# EAGLE design pcb (EAGLE 9.6.2)
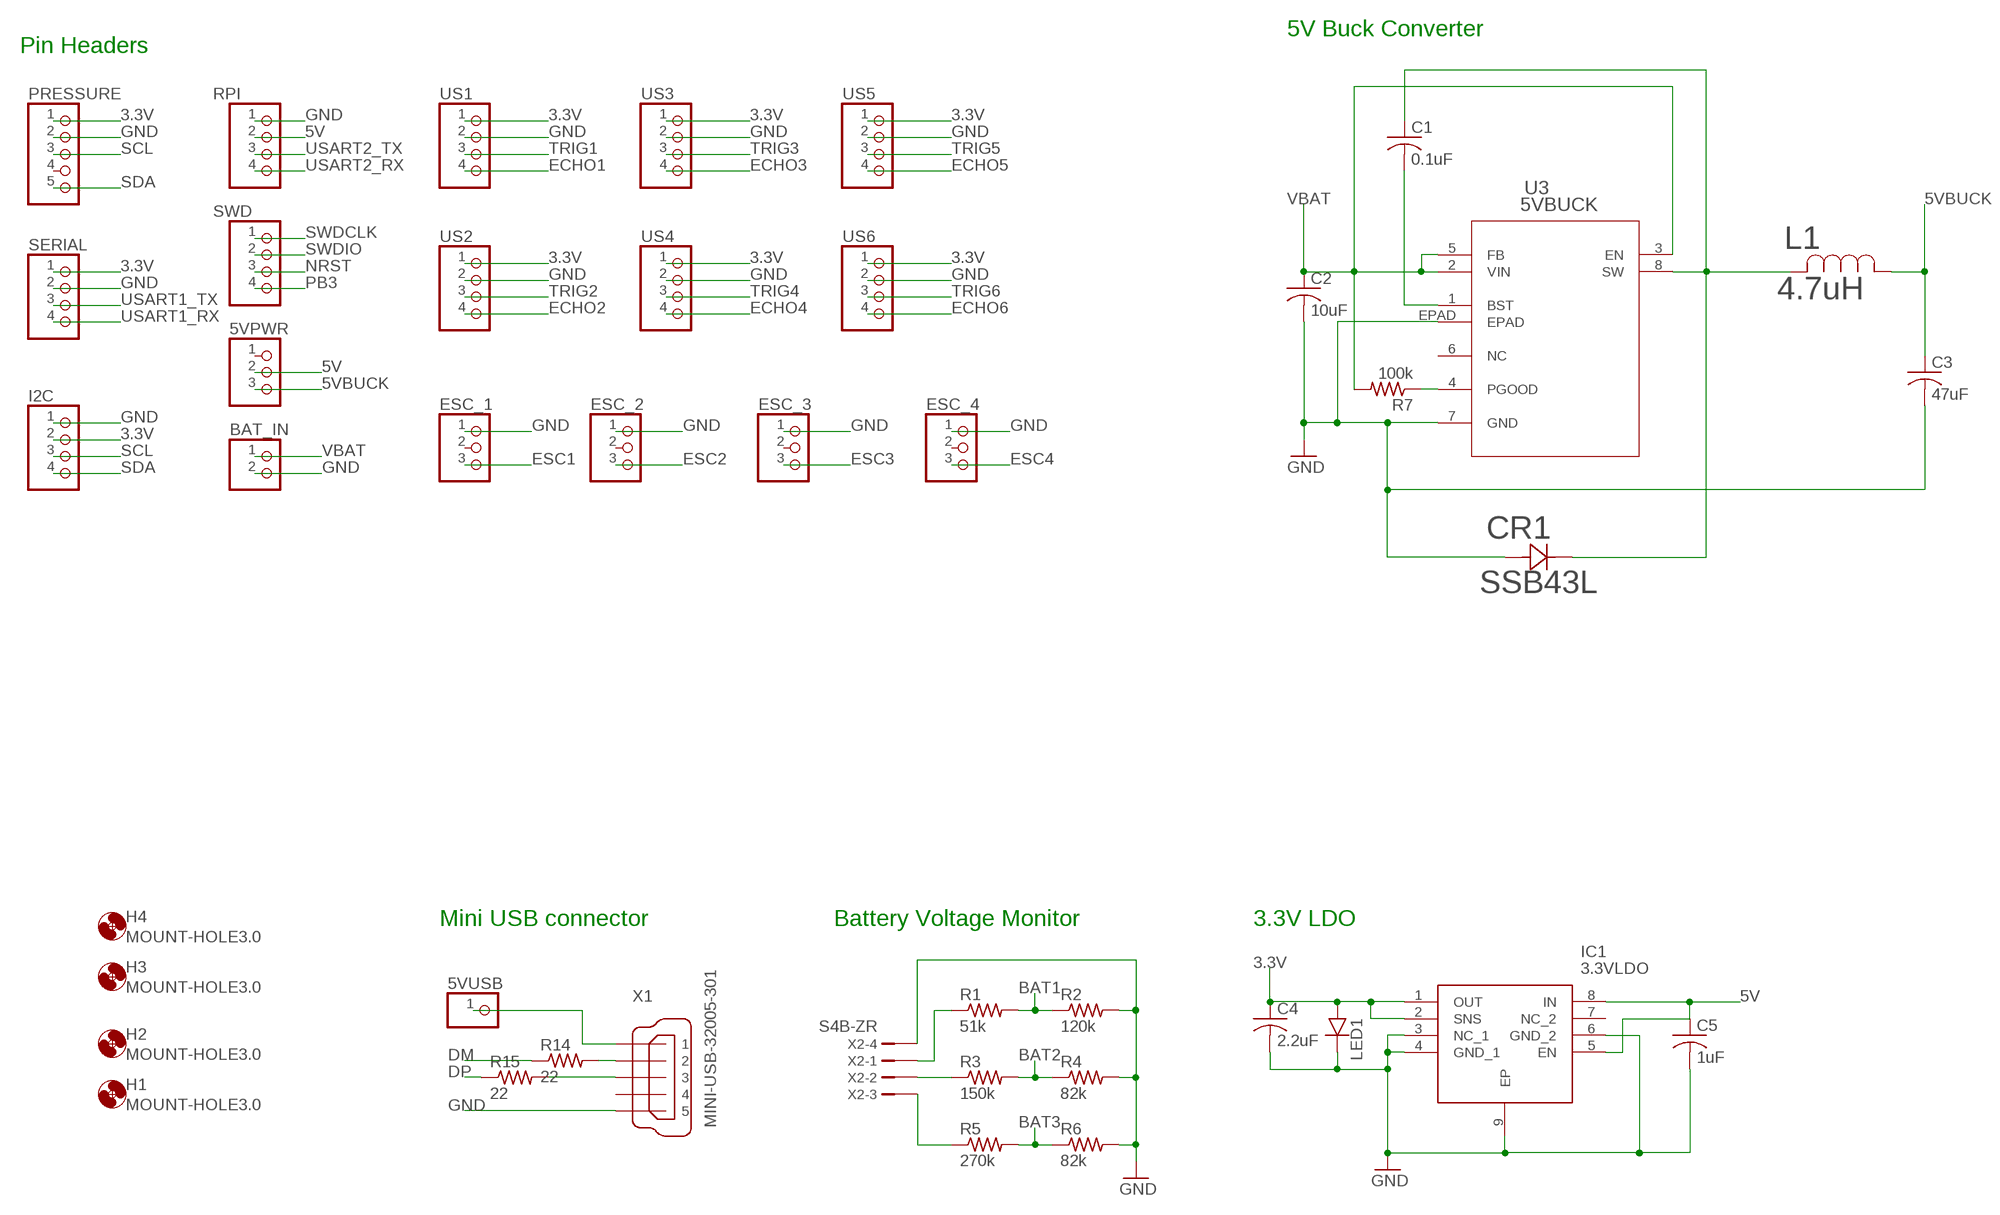
[diagram p0: schematic, sheet 1, part 1 of 2]
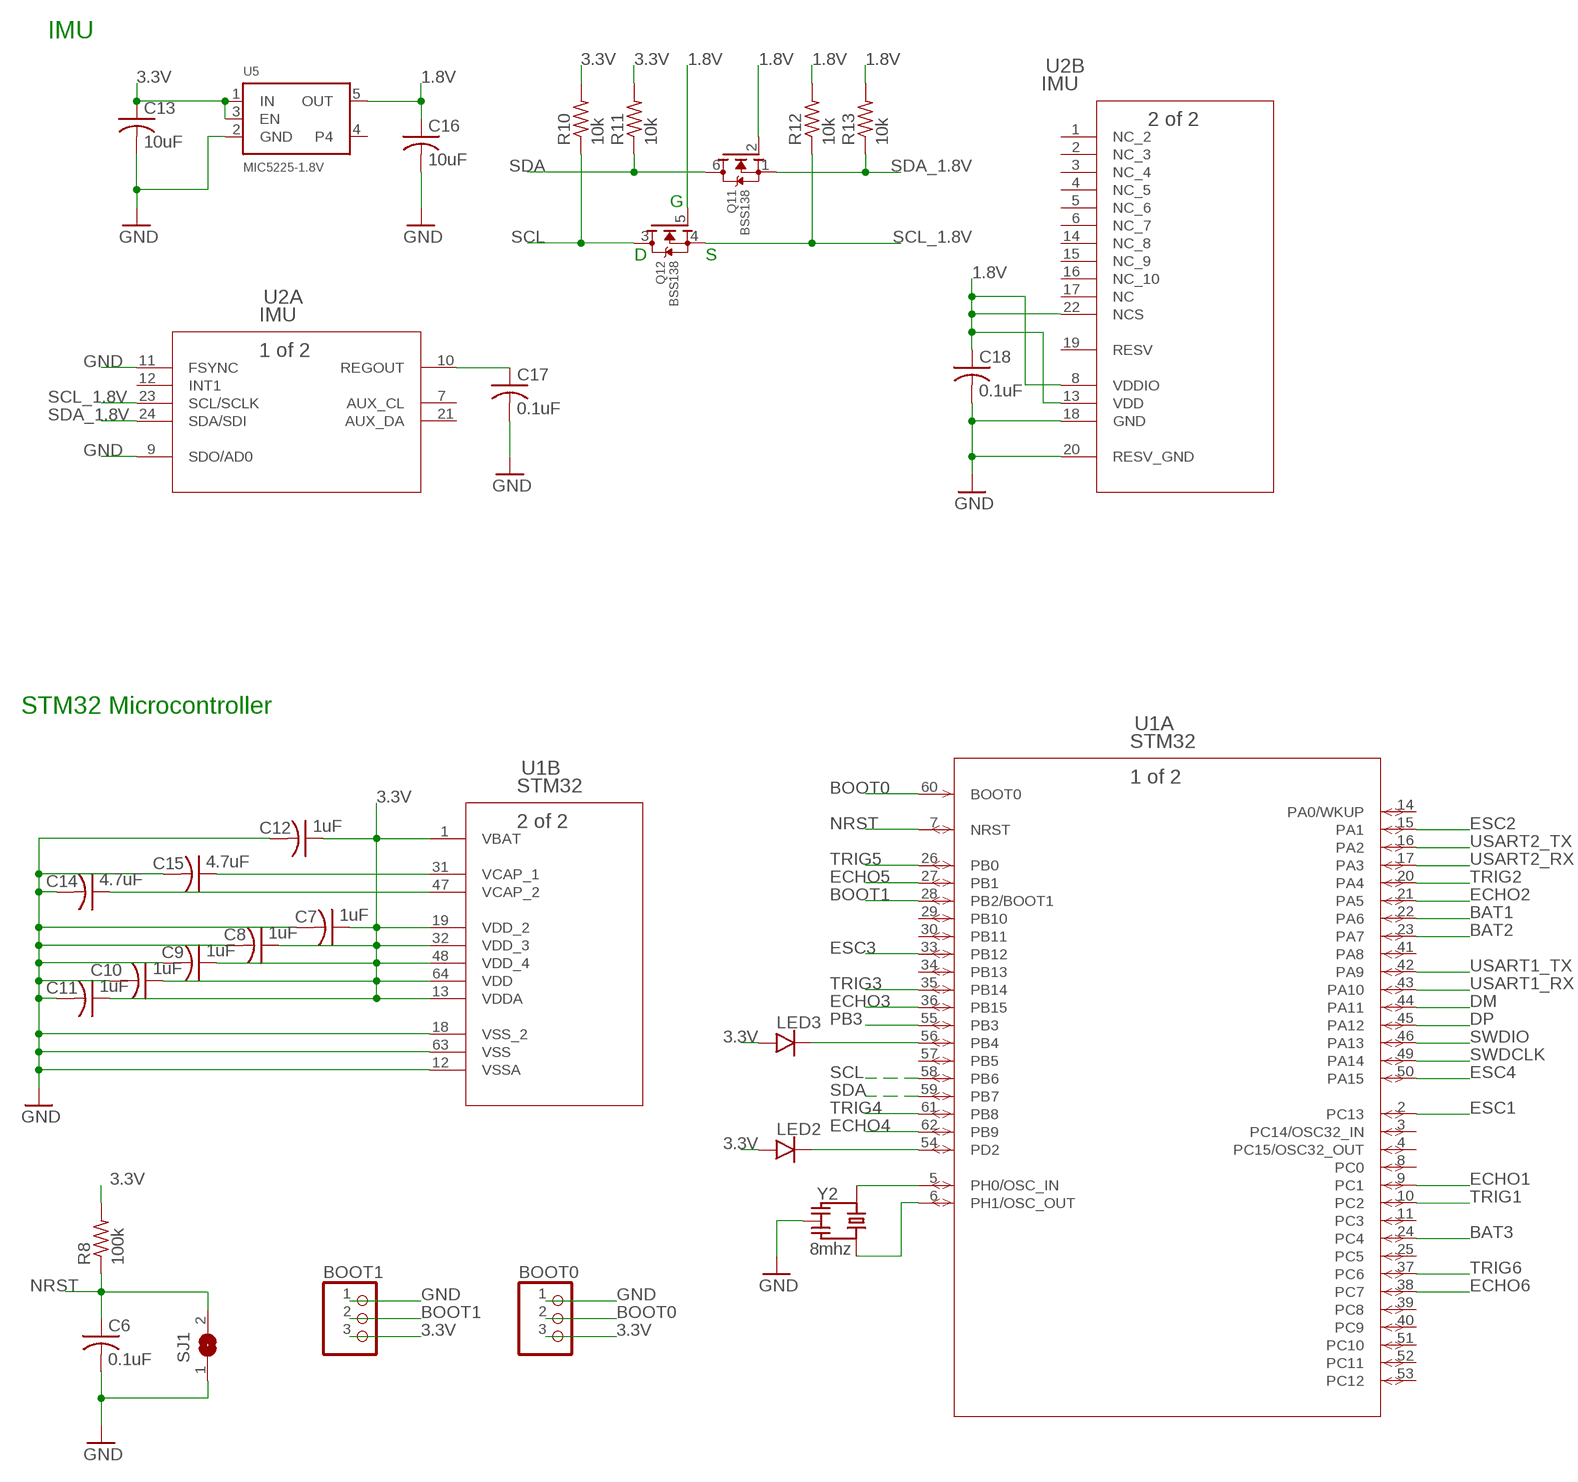
[diagram p1: schematic, sheet 1, part 2 of 2]

## Parts
5VPWR  PINHD-1X3  [1X03]
5VUSB  PINHD-1X1  [1X01]
BAT_IN  PINHD-1X2  [1X02]
BOOT0  PINHD-1X3  [1X03]
BOOT1  PINHD-1X3  [1X03]
C1  0.1uF  C-USC0805  [C0805]
C2  10uF  C-USC0805  [C0805]
C3  47uF  C-USC0805  [C0805]
C4  2.2uF  C-USC0805  [C0805]
C5  1uF  C-USC0805  [C0805]
C6  0.1uF  C-USC0805  [C0805]
C7  1uF  C-USC0805  [C0805]
C8  1uF  C-USC0805  [C0805]
C9  1uF  C-USC0805  [C0805]
C10  1uF  C-USC0805  [C0805]
C11  1uF  C-USC0805  [C0805]
C12  1uF  C-USC0805  [C0805]
C13  10uF  C-USC0805  [C0805]
C14  4.7uF  C-USC0805  [C0805]
C15  4.7uF  C-USC0805  [C0805]
C16  10uF  C-USC0805  [C0805]
C17  0.1uF  C-USC0805  [C0805]
C18  0.1uF  C-USC0805  [C0805]
CR1  SSB43L  SSB43L-E3/52TDIODE_DO214AA_MBRS-M  [DIODE_DO214AA_MBRS-M]
ESC_1  PINHD-1X3  [1X03]
ESC_2  PINHD-1X3  [1X03]
ESC_3  PINHD-1X3  [1X03]
ESC_4  PINHD-1X3  [1X03]
H1  MOUNT-HOLE3.0  [3,0]
H2  MOUNT-HOLE3.0  [3,0]
H3  MOUNT-HOLE3.0  [3,0]
H4  MOUNT-HOLE3.0  [3,0]
I2C  PINHD-1X4  [1X04]
IC1  3.3VLDO  TLV76733DGNR  [SOP65P490X110-9N]
L1  4.7uH  B82464G4472M  [IND_B82464G4_EPC]
LED1  SMD-CHIP-LED-0805  [SMD-CHIP-LED-0805]
LED2  SMD-CHIP-LED-0805  [SMD-CHIP-LED-0805]
LED3  SMD-CHIP-LED-0805  [SMD-CHIP-LED-0805]
PRESSURE  PINHD-1X5  [1X05]
Q1  BSS138  MOSFET-N_DUAL  [SOT363]
R1  51k  R-US_R0805  [R0805]
R2  120k  R-US_R0805  [R0805]
R3  150k  R-US_R0805  [R0805]
R4  82k  R-US_R0805  [R0805]
R5  270k  R-US_R0805  [R0805]
R6  82k  R-US_R0805  [R0805]
R7  100k  R-US_R0805  [R0805]
R8  100k  R-US_R0805  [R0805]
R10  10k  R-US_R0805  [R0805]
R11  10k  R-US_R0805  [R0805]
R12  10k  R-US_R0805  [R0805]
R13  10k  R-US_R0805  [R0805]
R14  22  R-US_R0805  [R0805]
R15  22  R-US_R0805  [R0805]
RPI  PINHD-1X4  [1X04]
SERIAL  PINHD-1X4  [1X04]
SJ1  SJ  [SJ]
SWD  PINHD-1X4  [1X04]
U1  STM32  STM32F405RGT6W  [LQFP64-10X10MM]
U2  IMU  ICM-20948  [QFN24_3X3X0P9_IVS]
U3  5VBUCK  ADP2303ARDZ-5.0-R7RD_8_1_ADI-M  [RD_8_1_ADI-M]
U5  MIC5225-1.8V  VREG_SOT23-5  [SOT23-5]
US1  PINHD-1X4  [1X04]
US2  PINHD-1X4  [1X04]
US3  PINHD-1X4  [1X04]
US4  PINHD-1X4  [1X04]
US5  PINHD-1X4  [1X04]
US6  PINHD-1X4  [1X04]
X1  MINI-USB-32005-301  [32005-301]
X2  S4B-ZR  [S4B-ZR]
Y2  8mhz  RESONATOR8MHZ  [RESONATOR_8]

## Nets
1.8V: C16.1 C18.1 Q1.2(1:G) Q1.5(2:G) R12.2 R13.2 U2.8(B:VDDIO) U2.13(B:VDD) U2.22(B:NCS) U5.5(OUT)
3.3V: BOOT0.3 BOOT1.3 C4.1 C7.1 C8.1 C9.1 C10.1 C11.1 C12.1 C13.1 I2C.2 IC1.1(OUT) IC1.2(SNS) LED1.A LED2.A LED3.A PRESSURE.1 R8.2 R10.2 R11.2 SERIAL.1 U1.1(B:VBAT) U1.13(B:VDDA) U1.19(B:VDD_2) U1.32(B:VDD_3) U1.48(B:VDD_4) U1.64(B:VDD) U5.1(IN) U5.3(EN) US1.1 US2.1 US3.1 US4.1 US5.1 US6.1
5V: 5VPWR.2 C5.1 IC1.5(EN) IC1.8(IN) RPI.2
5VBUCK: 5VPWR.3 C3.1 L1.1
BAT1: R1.2 R2.1 U1.22(A:PA6)
BAT2: R3.2 R4.1 U1.23(A:PA7)
BAT3: R5.2 R6.1 U1.24(A:PC4)
BOOT0: BOOT0.2 U1.60(A:BOOT0)
BOOT1: BOOT1.2 U1.28(A:PB2/BOOT1)
DM: R14.1 U1.44(A:PA11)
DP: R15.1 U1.45(A:PA12)
ECHO1: U1.9(A:PC1) US1.4
ECHO2: U1.21(A:PA5) US2.4
ECHO3: U1.36(A:PB15) US3.4
ECHO4: U1.62(A:PB9) US4.4
ECHO5: U1.27(A:PB1) US5.4
ECHO6: U1.38(A:PC7) US6.4
ESC1: ESC_1.3 U1.2(A:PC13)
ESC2: ESC_2.3 U1.15(A:PA1)
ESC3: ESC_3.3 U1.33(A:PB12)
ESC4: ESC_4.3 U1.50(A:PA15)
GND: BAT_IN.2 BOOT0.1 BOOT1.1 C2.2 C3.2 C4.2 C5.2 C6.2 C7.2 C8.2 C9.2 C10.2 C11.2 C12.2 C13.2 C14.2 C15.2 C16.2 C17.2 C18.2 CR1.2 ESC_1.1 ESC_2.1 ESC_3.1 ESC_4.1 I2C.1 IC1.3(NC_1) IC1.4(GND_1) IC1.6(GND_2) IC1.9(EP) LED1.C PRESSURE.2 R2.2 R4.2 R6.2 RPI.1 SERIAL.2 SJ1.1 U1.12(B:VSSA) U1.18(B:VSS_2) U1.63(B:VSS) U2.9(A:SDO/AD0) U2.11(A:FSYNC) U2.18(B:GND) U2.20(B:RESV_GND) U3.7(GND) U3.EPAD U5.2(GND) US1.2 US2.2 US3.2 US4.2 US5.2 US6.2 X1.5 X2.4 Y2.2
N$1: R5.1 X2.3
N$2: C17.1 U2.10(A:REGOUT)
N$3: R14.2 X1.2
N$4: R3.1 X2.2
N$5: R1.1 X2.1
N$6: U1.5(A:PH0/OSC_IN) Y2.1
N$7: R15.2 X1.3
N$8: 5VUSB.1 X1.1
N$9: U1.6(A:PH1/OSC_OUT) Y2.3
N$12: C1.2 U3.1(BST)
N$13: R7.1 U3.4(PGOOD)
N$14: C1.1 CR1.1 L1.2 U3.8(SW)
N$15: C15.1 U1.31(B:VCAP_1)
N$16: C14.1 U1.47(B:VCAP_2)
N$19: LED3.C U1.56(A:PB4)
N$20: LED2.C U1.54(A:PD2)
NRST: C6.1 R8.1 SJ1.2 SWD.3 U1.7(A:NRST)
PB3: SWD.4 U1.55(A:PB3)
SCL: I2C.3 PRESSURE.3 Q1.3(2:D) R10.1 U1.58(A:PB6)
SCL_1.8V: Q1.4(2:S) R12.1 U2.23(A:SCL/SCLK)
SDA: I2C.4 PRESSURE.5 Q1.6(1:D) R11.1 U1.59(A:PB7)
SDA_1.8V: Q1.1(1:S) R13.1 U2.24(A:SDA/SDI)
SWDCLK: SWD.1 U1.49(A:PA14)
SWDIO: SWD.2 U1.46(A:PA13)
TRIG1: U1.10(A:PC2) US1.3
TRIG2: U1.20(A:PA4) US2.3
TRIG3: U1.35(A:PB14) US3.3
TRIG4: U1.61(A:PB8) US4.3
TRIG5: U1.26(A:PB0) US5.3
TRIG6: U1.37(A:PC6) US6.3
USART1_RX: SERIAL.4 U1.43(A:PA10)
USART1_TX: SERIAL.3 U1.42(A:PA9)
USART2_RX: RPI.4 U1.17(A:PA3)
USART2_TX: RPI.3 U1.16(A:PA2)
VBAT: BAT_IN.1 C2.1 R7.2 U3.2(VIN) U3.3(EN) U3.5(FB)
Unconnected: 5VPWR.1 ESC_1.2 ESC_2.2 ESC_3.2 ESC_4.2 IC1.7(NC_2) PRESSURE.4 U1.3(A:PC14/OSC32_IN) U1.4(A:PC15/OSC32_OUT) U1.8(A:PC0) U1.11(A:PC3) U1.14(A:PA0/WKUP) U1.25(A:PC5) U1.29(A:PB10) U1.30(A:PB11) U1.34(A:PB13) U1.39(A:PC8) U1.40(A:PC9) U1.41(A:PA8) U1.51(A:PC10) U1.52(A:PC11) U1.53(A:PC12) U1.57(A:PB5) U2.1(B:NC_2) U2.2(B:NC_3) U2.3(B:NC_4) U2.4(B:NC_5) U2.5(B:NC_6) U2.6(B:NC_7) U2.7(A:AUX_CL) U2.12(A:INT1) U2.14(B:NC_8) U2.15(B:NC_9) U2.16(B:NC_10) U2.17(B:NC) U2.19(B:RESV) U2.21(A:AUX_DA) U3.6(NC) U5.4 X1.4

## Notes on the sheet
- 5V Buck Converter
- Pin Headers
- IMU
- G
- D | S
- STM32 Microcontroller
- Mini USB connector | Battery Voltage Monitor | 3.3V LDO

## Library data of the parts
5VPWR BOOT0 BOOT1 ESC_1-ESC_4 = pinhead:PINHD-1X3: PIN HEADER
5VUSB = pinhead:PINHD-1X1: PIN HEADER
BAT_IN = pinhead:PINHD-1X2: PIN HEADER
C1-C18 = rcl:C-US: CAPACITOR, American symbol; SPICEPREFIX: C
CR1 = ssb43l:SSB43L-E3/52T; BUILT_BY: EMA_UL_Team; MANUFACTURER_PART_NUMBER: SSB43L-E3/52T; VENDOR: Vishay
H1-H4 = holes:MOUNT-HOLE: MOUNTING HOLE with drill center marker
I2C RPI SERIAL SWD US1-US6 = pinhead:PINHD-1X4: PIN HEADER
IC1 = SamacSys_Parts:TLV76733DGNR: LDO Voltage Regulators 1-A, 16-V, high-PSRR, high-accuracy, low-dropout voltage regulator with enable Source: Datasheet <https://www.ti.com/lit/ds/symlink/tlv767.pdf?ts=1601893180135&ref_url=https%3A%2F%2Fduckduckgo.com%2F>; DESCRIPTION: LDO Voltage Regulators 1-A, 16-V, high-PSRR, high-accuracy, low-dropout voltage regulator with enable; HEIGHT: 1.1mm; MANUFACTURER_NAME: Texas Instruments; MANUFACTURER_PART_NUMBER: TLV76733DGNR; MOUSER_PART_NUMBER: 595-TLV76733DGNR; MOUSER_PRICE-STOCK: https://www.mouser.co.uk/ProductDetail/Texas-Instruments/TLV76733DGNR?qs=W%2FMpXkg%252BdQ7WCurh%2FfEdlw%3D%3D
L1 = b82464:B82464G4472M; BUILT_BY: EMA_UL_Team; MANUFACTURER_PART_NUMBER: B82464G4472M; SOURCELIBRARY: Epcos_2014-06-19; VENDOR: Epcos
LED1-LED3 = alienflight:SMD-CHIP-LED-0805: SMD CHIP LED APHCM2012QBC/D-F01 View Datasheet <https://www.kingbrightusa.com/images/catalog/spec/APHCM2012QBC-D-F01.pdf> Author: Lance Source: http://alienflight.com License: CC BY SA <creativecommons.org/licenses/by-sa/4.0/>; MF: Kingbright; MPN: APHCM2012QBC/D-F01
PRESSURE = pinhead:PINHD-1X5: PIN HEADER
Q1 = microbuilder:MOSFET-N_DUAL: Dual N-Channel MOSFET SOT363 (2.0x1.25mm) 2N7002PS - 60V, 320mA [Digikey: 568-5984-1-ND]
R1-R8 R10-R15 = rcl:R-US_: RESISTOR, American symbol; SPICEPREFIX: R
SJ1 = jumper:SJ: SMD solder JUMPER
U1 = STM32F405RGT6W:STM32F405RGT6W; BUILT_BY: EMA_UL_Team; COPYRIGHT: Copyright (C) 2018 Accelerated Designs. All rights reserved; MANUFACTURER_PART_NUMBER: STM32F405RGT6W; SOURCELIBRARY: STMicroelectronics_2020-10-07; VENDOR: STMicroelectronics
U2 = ICM20948:ICM-20948; BUILT_BY: EMA_Cory; COPYRIGHT: Copyright (C) 2018 Accelerated Designs. All rights reserved; DATASHEET: https://invensense.tdk.com/wp-content/uploads/2016/06/DS-000189-ICM-20948-v1.3.pdf?ref_disty=digikey; MANUFACTURER_PART_NUMBER: ICM-20948; SOURCELIBRARY: InvenSense_2020-09-29; VENDOR: InvenSense
U3 = ADP2303ARDZ:ADP2303ARDZ-5.0-R7; BUILT_BY: EMA_UL_Team; MANUFACTURER_PART_NUMBER: ADP2303ARDZ-5.0-R7; SOURCELIBRARY: Analog_2015-01-06; VENDOR: Analog Devices Inc
U5 = microbuilder:VREG_SOT23-5: SOT23-5 Fixed Voltage Regulators Part Current Out V Out V In V Dropout θJA (°C/W) TJ (°C) Digikey Part No. ADP121 150mA 3.3V 3.4-5.5V 0.09V @ 150mA -- -- ADP121-AUJZ33R7CT-ND ADP121 150mA 3.0V 3.1-5.5V 0.09V @ 150mA -- -- ADP121-AUJZ30R7CT-ND ADP122 300mA 3.3V 3.4-5.5V 0.085V @ 300mA -- -- ADP122AUJZ-3.3-R7CT-ND ADP1712 300mA 3.3V 3.5-5.5V 0.17V @ 300mA -- -- ADP1712AUJZ-3.3-R7TR-ND AP7311 (Low Cost) 150mA 3.3V 3.5-6V 0.15V @ 150mA -- -- AP7311-33WG-7DICT-ND LD39015M18R 150mA 1.8V 1.9V-5.5V 0.08V @ 100mA -- -- 497-6977-1-ND LP2985A-33DBVR 150mA 3.3V 3.3-16V 0.28V @ 150mA 206 150 296-18479-1-ND MCP1824T-3302E/OT 300mA 3.3V 3.5V-6V 0.2V @ 300mA -- -- MCP1824T-3302E/OTCT-ND MIC5205-2.5YM5 TR 150mA 2.5V 2.7-16V 0.165V @ 150mA -- -- 576-1257-2-ND MIC5205-3.0YM5 TR 150mA 3.0V 3.2V-16V 0.165V @ 150mA -- -- 576-1258-2-ND MIC5205-3.3YM5 TR 150mA 3.3V 3.5V-16V 0.165V @ 150mA -- -- 576-1259-2-ND TPS780330220 150mA 3.3V+2.2V 3.6-5.5V 250mV Max -- -- 296-23332-1-ND TDA3663/N1,135 100mA 3.3V 3.5-45V 0.18V @ 50mA -- -- 568-5343-1-ND Max operating temp can be calculated using θJA, TJ (max junction temperature), and power in watts. Set the "Maximum Ambient Temperature" until it reaches TJ ("Max Junction Temperature"), which is the absolute limit for safe use of the regulator: Heat Sink Temperature Calculator <http://www.daycounter.com/Calculators/Heat-Sink-Temperature-Calculator.phtml> For example, With 12V source into a 3.3V LP2985 and a 30mA load, we are dissipating (12V-3.3V) * 0.03A = 0.261W. With a θJA of 206 °C/W, a TJ of 150°C, and 261mW we can safely use the chip without a heat sink up to 75°C (=147.1°C Junction Temperature).
X1 = con-cypressindustries:MINI-USB-: MINI USB-B Conector Source: www.cypressindustries.com; OC_FARNELL: unknown; OC_NEWARK: unknown
X2 = con-jst:?4B-ZR: ZH CONNECTOR 1.5 mm, 4 pin 1 row Source: http://www.jst.com .. eZH.pdf; MF: FARNELL; MPN: S4B-ZR(LF)(SN); OC_FARNELL: 9491830; OC_NEWARK: 38K8076
Y2 = alienflight:RESONATOR: SMD Ceramic Resonators Ceralock Murata Datasheet <http://www.murata.com/~/media/webrenewal/support/library/catalog/products/timingdevice/ceralock/p16e.ashx> Author: Lance Source: http://alienflight.com License: CC BY SA <creativecommons.org/licenses/by-sa/4.0/>; MF: Murata; MPN: CSTCE8M00G55-R0

## Board
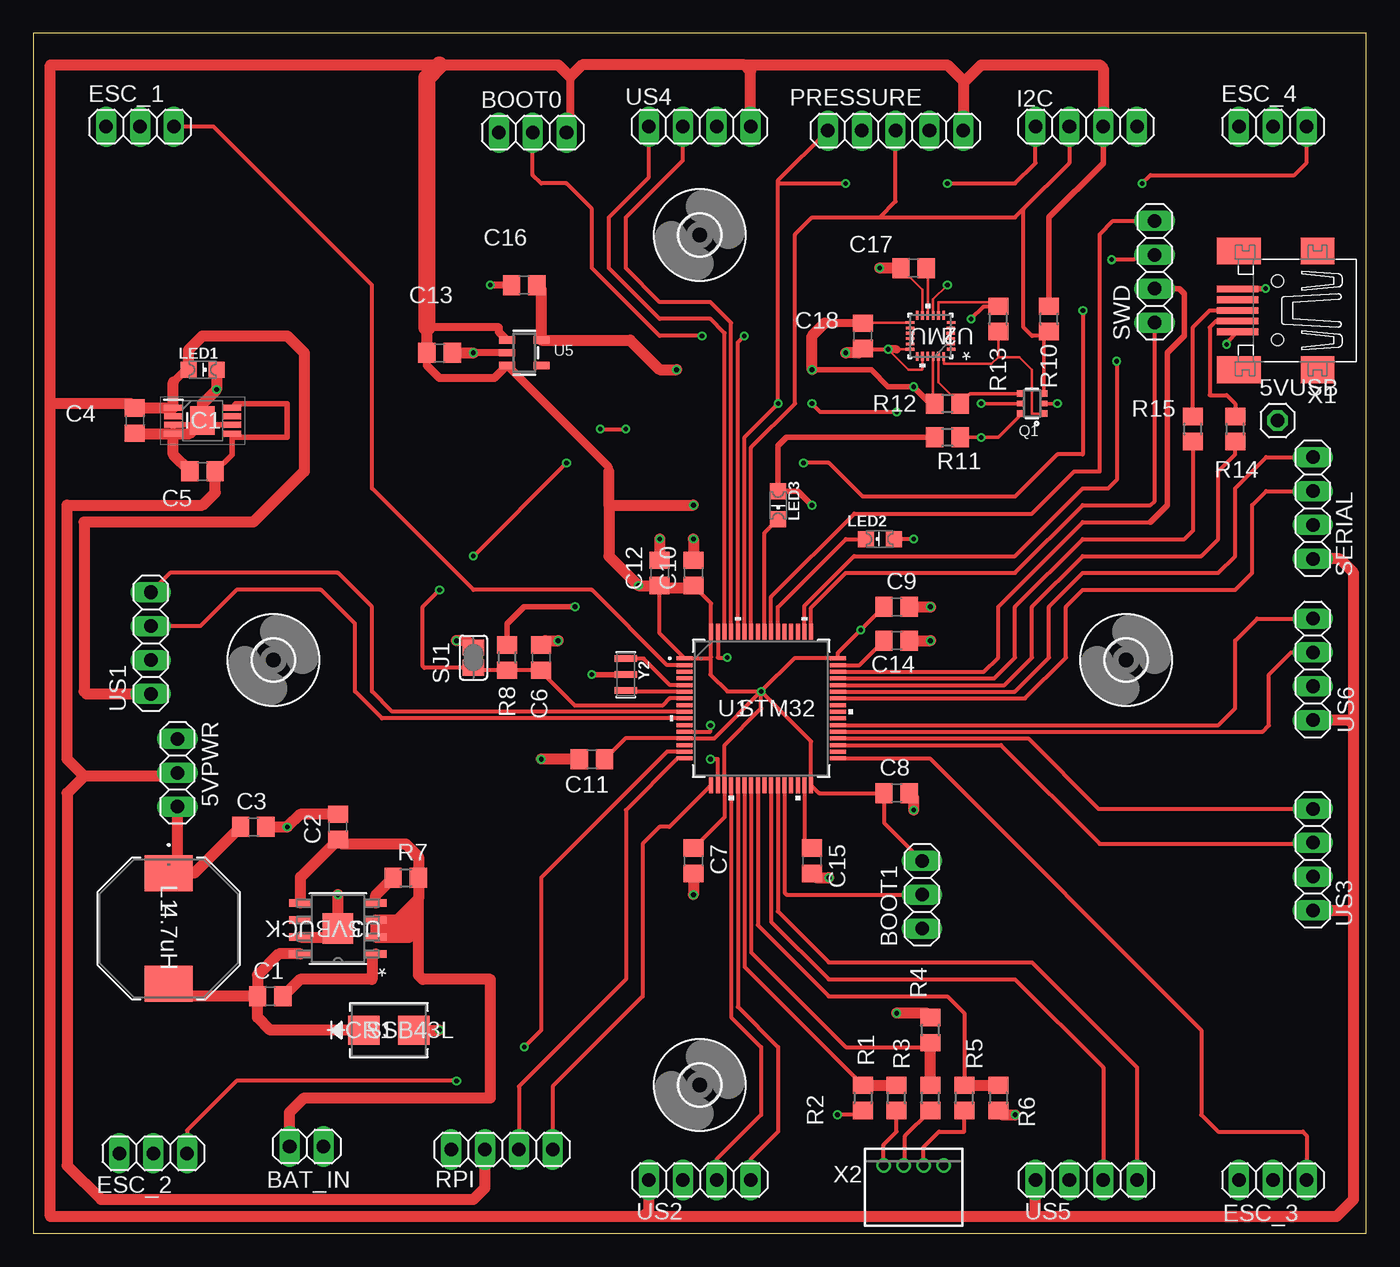
[diagram p2: board, top side]
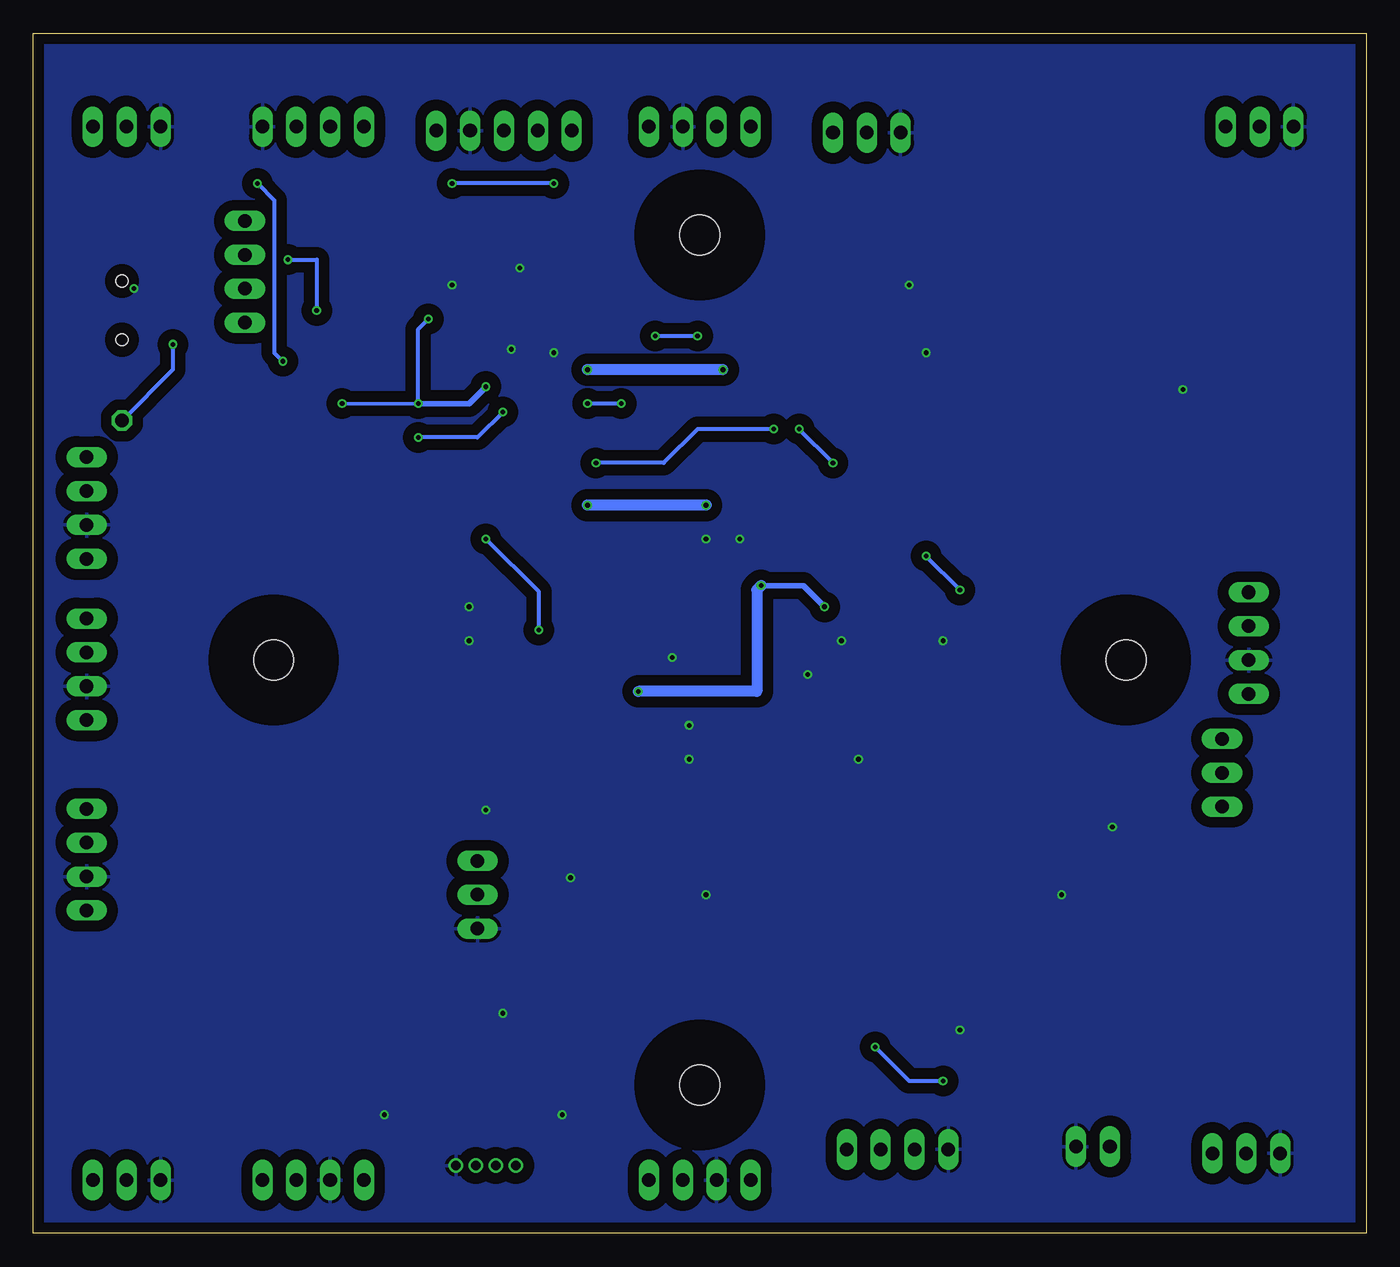
[diagram p3: board, bottom side, seen from below]

Size 100 x 90 mm. Coordinates in mm from the lower left corner, seen from the top.
Outline: 0,0 100,0 100,90 0,90 0,0
Copper layers (1*16): Top 0.035mm / dielectric 1.5mm / Bottom 0.035mm
Design rules "PCBWay_2layer": minimum track width 6mil, minimum drill 0.3mm, track to track 6mil, track to pad 6mil, pad to pad 6mil, via to via 6mil, smd to smd 4mil, copper to edge 10mil, drill to drill 6mil, minimum pad ring 6mil, minimum via ring 6mil, stop-mask expansion 4mil, vias tented up to drill 0.8mm, thermal gap 10mil

### Footprints (pad centres in the part's own frame; a part is rotated, then mirrored left to right if it is on the bottom)
1X03 = drill 1.016 long: 1 -2.54,0; 2 0,0; 3 2.54,0
1X01 = drill 1.016 octagon: 1 0,0
1X02 = drill 1.016 long: 1 -1.27,0; 2 1.27,0
C0805 = smd 1.3 x 1.5: 1 -0.95,0; 2 0.95,0
DIODE_DO214AA_MBRS-M = smd 2.345 x 2.159: 1 -1.871,0; 2 1.871,0
3,0 = hole 3: 0,0
1X04 = drill 1.016 long: 1 -3.81,0; 2 -1.27,0; 3 1.27,0; 4 3.81,0
SOP65P490X110-9N = smd 1.4 x 0.45: 1 -2.2,0.975; 2 -2.2,0.325; 3 -2.2,-0.325; 4 -2.2,-0.975; 5 2.2,-0.975; 6 2.2,-0.325; 7 2.2,0.325; 8 2.2,0.975 | smd 1.846 x 2.15: 9 0,0
IND_B82464G4_EPC = smd 2.705 x 3.607: 1 -4.147,0; 2 4.147,0
SMD-CHIP-LED-0805 = smd 1.2 x 1.2: A -1.05,0; C 1.05,0
1X05 = drill 1.016 long: 1 -5.08,0; 2 -2.54,0; 3 0,0; 4 2.54,0; 5 5.08,0
SOT363 = smd 0.5 x 0.5: 1 -0.75,-0.9; 3 0.75,-0.9; 4 0.75,0.9; 6 -0.75,0.9 | smd 0.4 x 0.5: 2 0,-0.9; 5 0,0.9
R0805 = smd 1.3 x 1.5: 1 -0.95,0; 2 0.95,0
SJ = smd 1.168 x 1.6: 1 -0.762,0; 2 0.762,0
LQFP64-10X10MM = smd 1.194 x 0.305: 1 -5.75,3.75; 2 -5.75,3.25; 3 -5.75,2.75; 4 -5.75,2.25; 5 -5.75,1.75; 6 -5.75,1.25; 7 -5.75,0.75; 8 -5.75,0.25; 9 -5.75,-0.25; 10 -5.75,-0.75; 11 -5.75,-1.25; 12 -5.75,-1.75; 13 -5.75,-2.25; 14 -5.75,-2.75; 15 -5.75,-3.25; 16 -5.75,-3.75; 33 5.75,-3.75; 34 5.75,-3.25; 35 5.75,-2.75; 36 5.75,-2.25; 37 5.75,-1.75; 38 5.75,-1.25; 39 5.75,-0.75; 40 5.75,-0.25; 41 5.75,0.25; 42 5.75,0.75; 43 5.75,1.25; 44 5.75,1.75; 45 5.75,2.25; 46 5.75,2.75; 47 5.75,3.25; 48 5.75,3.75 | smd 0.305 x 1.194: 17 -3.75,-5.75; 18 -3.25,-5.75; 19 -2.75,-5.75; 20 -2.25,-5.75; 21 -1.75,-5.75; 22 -1.25,-5.75; 23 -0.75,-5.75; 24 -0.25,-5.75; 25 0.25,-5.75; 26 0.75,-5.75; 27 1.25,-5.75; 28 1.75,-5.75; 29 2.25,-5.75; 30 2.75,-5.75; 31 3.25,-5.75; 32 3.75,-5.75; 49 3.75,5.75; 50 3.25,5.75; 51 2.75,5.75; 52 2.25,5.75; 53 1.75,5.75; 54 1.25,5.75; 55 0.75,5.75; 56 0.25,5.75; 57 -0.25,5.75; 58 -0.75,5.75; 59 -1.25,5.75; 60 -1.75,5.75; 61 -2.25,5.75; 62 -2.75,5.75; 63 -3.25,5.75; 64 -3.75,5.75
QFN24_3X3X0P9_IVS = smd 0.656 x 0.204: 1 -1.547,1; 2 -1.522,0.6; 3 -1.522,0.2; 4 -1.522,-0.2; 5 -1.522,-0.6; 6 -1.547,-1; 13 1.547,-1; 14 1.522,-0.6; 15 1.522,-0.2; 16 1.522,0.2; 17 1.522,0.6; 18 1.547,1 | smd 0.204 x 0.656: 7 -1,-1.547; 8 -0.6,-1.522; 9 -0.2,-1.522; 10 0.2,-1.522; 11 0.6,-1.522; 12 1,-1.547; 19 1,1.547; 20 0.6,1.522; 21 0.2,1.522; 22 -0.2,1.522; 23 -0.6,1.522; 24 -1,1.547
RD_8_1_ADI-M = smd 1.655 x 0.558: 1 -2.821,1.905; 2 -2.821,0.635; 3 -2.821,-0.635; 4 -2.821,-1.905; 5 2.821,-1.905; 6 2.821,-0.635; 7 2.821,0.635; 8 2.821,1.905 | smd 2.286 x 2.286: EPAD 0,0
SOT23-5 = smd 0.55 x 1.2: 1 -0.95,-1.3; 2 0,-1.3; 3 0.95,-1.3; 4 0.95,1.3; 5 -0.95,1.3
32005-301 = smd 3.1 x 0.5: 1 3,1.6; 2 3,0.8; 3 3,0; 4 3,-0.8; 5 3,-1.6 | smd 2.5 x 2: M1 -3,-4.45; M2 -3,4.45 | smd 3.3 x 2: M3 2.9,4.45; M4 2.9,-4.45 | hole 0.9: 0,2.2; 0,-2.2
S4B-ZR = drill 0.7 pad 1.1: 1 -2.25,0; 2 -0.75,0; 3 0.75,0; 4 2.25,0
RESONATOR_8 = smd 0.5 x 1.7: 1 -1.2,0; 2 0,0; 3 1.2,0

### Placement (x,y rotation side)
5VPWR  10.81,34.54 270 top
5VUSB  93.34,60.96 0 top
BAT_IN  20.5,6.51 0 top
BOOT0  37.47,82.55 0 top
BOOT1  66.67,25.4 90 top
C1  17.78,17.78 0 top
C2  22.86,30.48 90 top
C3  16.51,30.48 0 top
C4  7.62,60.96 270 top
C5  12.7,57.15 180 top
C6  38.1,43.18 90 top
C7  49.53,27.94 270 top
C8  64.77,33.02 0 top
C9  64.77,46.99 0 top
C10  49.53,49.53 90 top
C11  41.91,35.56 180 top
C12  46.99,49.53 90 top
C13  30.48,66.04 0 top
C14  64.77,44.45 0 top
C15  58.42,27.94 270 top
C16  36.83,71.12 180 top
C17  66.04,72.39 180 top
C18  62.23,67.31 270 top
CR1  26.67,15.24 0 top
ESC_1  8,83 0 top
ESC_2  9,6 0 top
ESC_3  93,4 0 top
ESC_4  93,83 0 top
H1  50,11.12 0 top
H2  18.02,43 0 top
H3  81.97,43 0 top
H4  50,74.88 0 top
I2C  79,83 180 top
IC1  12.7,60.96 0 top
L1  10.16,22.86 270 top
LED1  12.7,64.77 0 top
LED2  63.5,52.07 180 top
LED3  55.88,54.61 270 top
PRESSURE  64.69,82.7 180 top
Q1  74.93,62.23 90 top
R1  64.77,10.16 90 top
R2  62.23,10.16 270 top
R3  67.31,10.16 90 top
R4  67.31,15.24 90 top
R5  69.85,10.16 90 top
R6  72.39,10.16 270 top
R7  27.94,26.67 0 top
R8  35.56,43.18 90 top
R10  76.2,68.58 90 top
R11  68.58,59.69 180 top
R12  68.58,62.23 180 top
R13  72.39,68.58 90 top
R14  90.17,60.33 90 top
R15  87,60.33 90 top
RPI  35.16,6.29 0 top
SERIAL  96,54.4 90 top
SJ1  33.02,43.18 270 top
SWD  84.13,72.12 90 top
U1  54.61,39.37 0 top
U2  67.31,67.31 180 top
U3  22.86,22.86 180 top
U5  36.83,66.04 270 top
US1  8.81,44.27 90 top
US2  50,4 0 top
US3  96,28.03 90 top
US4  50,83 180 top
US5  79,4 0 top
US6  96,42.3 90 top
X1  93.34,69.22 180 top
X2  66.04,5.08 0 top
Y2  44.45,41.91 270 top

### Tracks (layer width: path | path; a pad name or v marks a point on that pad's centre or on a via)
1.8V  (via drill 0.35)
  Top 0.203: U2.22 67.51,62.35 | R13.2 72.39,69.85 67.91,69.85 U2.8 | U2.13 62.28,68.31 C18.1
  Top 0.254: 67.51,62.35 R12.2 | Q1.5 v71.12,62.23 | v76.83,62.23 Q1.2
  Top 0.305: v70.36,68.58 71.31,69.53 R13.2
  Top 0.406: v58.42,64.77 62.87,64.77 64.14,63.5 v66.04,63.5 67.19,62.35 67.51,62.35
  Top 0.61: C18.1 59.37,68.26
  Top 0.813: C16.1 38.13,70.77 U5.5 44.77,66.99 46.99,64.77 v48.26,64.77 | v58.42,64.77 58.42,67.31 59.37,68.26
  Bottom 0.254: v71.12,62.23 v76.83,62.23
  Bottom 0.305: v71.12,62.23 71.12,67.82 v70.36,68.58
  Bottom 0.406: v66.04,63.5 67.31,62.23 v71.12,62.23
  Bottom 0.813: v48.26,64.77 v58.42,64.77
3.3V  (via drill 0.35)
  Top 0.305: C7.1 51.86,31.22 U1.19 51.86,36.62 54.61,39.37 v54.61,40.64 | C9.1 v62.07,45.24 60.36,43.53 U1.48 57.09,43.12 v54.61,40.64 | C10.1 49.69,48.42 50.86,47.25 U1.64 50.86,43.24 50.74,43.12 | C12.1 46.99,44.99 U1.1 50.74,43.12 | C11.1 44.42,37.12 U1.13 51.09,37.12 v54.61,40.64 | 50.74,43.12 50.8,43.06 50.8,41.91 52.07,40.64 v54.61,40.64 | v54.61,40.64 58.36,36.89 U1.32 58.96,33.02 C8.1 63.82,30.8 BOOT1.3 | v66.04,52.07 LED2.A
  Top 0.406: IC1.1 IC1.2 | R8.2 35.56,45.72 36.83,46.99 v40.64,46.99 | I2C.2 80.27,80.27 76.2,76.2 R10.2 | v58.42,54.61 57.37,55.66 LED3.A 55.88,59.05 56.52,59.69 R11.2
  Top 0.61: U5.1 34.92,67.59 34.92,67.94 29.53,67.94 | C13.1 29.53,65.08 30.48,64.14 34.58,64.14 U5.3 43.18,57.44 43.18,57.15 | 10.5,63.84 11.43,64.77 LED1.A | 40.27,86.73 40.27,82.81 BOOT0.3
  Top 0.813: 10.5,63.84 IC1.1 7.64,61.94 C4.1 7.3,62.23 1.27,62.23 | 1.27,62.23 1.27,1.27 45.72,1.27 | 45.72,1.27 46.19,1.74 US2.1 | 45.72,1.27 74.93,1.27 | 74.93,1.27 75.19,1.53 US5.1 | LED1.A 11.65,66.26 12.7,67.31 19.05,67.31 20.32,66.04 20.32,57.15 16.51,53.34 3.81,53.34 3.81,40.64 3.99,40.46 US1.1 | 1.27,62.23 1.27,87.63 30.48,87.63 39.37,87.63 40.27,86.73 41.17,87.63 53.34,87.63 | US4.1 53.81,87.16 53.34,87.63 | 53.34,87.63 68.58,87.63 69.77,86.44 | 69.77,86.44 PRESSURE.1 | 69.77,86.44 69.93,86.44 71.12,87.63 80.01,87.63 80.27,87.37 I2C.2 | 49.69,48.42 47.15,48.42 C12.1 v45.4,48.58 43.18,50.8 43.18,54.61 | 43.18,54.61 43.18,57.15 | 74.93,1.27 97.79,1.27 99.06,2.54 99.06,24.13 98.97,24.22 | US3.1 98.97,24.22 | 98.97,24.22 99.06,24.31 99.06,38.1 | 99.06,38.1 98.67,38.49 US6.1 | 99.06,38.1 99.06,49.53 98,50.59 SERIAL.1 | 43.18,54.61 v49.53,54.61 | C13.1 29.53,67.94
  Top 1.27: 29.53,67.94 29.53,86.68 30.48,87.63
  Bottom 0.305: v62.07,45.24 62.07,48.1 v66.04,52.07
  Bottom 0.406: v40.64,46.99 42.23,48.58 v45.4,48.58
  Bottom 0.813: v45.4,48.58 45.72,48.26 45.72,40.64 v54.61,40.64 | v49.53,54.61 v58.42,54.61
5V
  Top 0.406: IC1.8 15.2,62.23 19.05,62.23 19.05,59.69 15.2,59.69 IC1.5 14.9,58.4 C5.1
  Top 0.813: 5VPWR.2 10.56,34.29 3.81,34.29 | 3.81,34.29 2.54,35.56 2.54,54.61 12.7,54.61 13.65,55.56 C5.1 | 3.81,34.29 2.54,33.02 2.54,5.08 5.08,2.54 33.02,2.54 33.89,3.41 RPI.2
5VBUCK
  Top 0.813: 5VPWR.3 10.81,27.66 L1.1 12.09,27.01 C3.1
BAT1
  Top 0.305: U1.22 53.36,19.98 R2.1
  Top 0.813: R2.1 R1.2
BAT2
  Top 0.305: U1.23 53.86,21.07 60.96,13.97 66.99,13.97 R4.1
  Top 0.813: R3.2 R4.1
BAT3
  Top 0.305: U1.24 54.36,23.11 59.69,17.78 68.58,17.78 69.85,16.51 R5.2
  Top 0.813: R5.2 R6.1
BOOT0  (via drill 0.35)
  Top 0.305: U1.60 52.86,66.83 v53.34,67.31 | v50.16,67.31 46.99,67.31 41.91,72.39 41.91,76.83 40.01,78.74 38.1,78.74 37.47,79.38 BOOT0.2
  Bottom 0.305: v53.34,67.31 v50.16,67.31
BOOT1
  Top 0.305: U1.28 56.36,25.55 56.52,25.4 BOOT1.2
DM
  Top 0.305: U1.44 72.87,41.12 74.93,43.18 74.93,46.99 78.74,50.8 87.63,50.8 88.9,52.07 88.9,57.15 90.17,58.42 R14.1
DP
  Top 0.305: U1.45 72.1,41.62 73.66,43.18 73.66,46.99 78.74,52.07 86.36,52.07 87,52.7 R15.1
ECHO1
  Top 0.305: U1.9 26.92,39.12 25.4,40.64 25.4,46.99 22.86,49.53 10.26,49.53 US1.4
ECHO2
  Top 0.305: U1.21 52.86,16.99 55.88,13.97 55.88,7.62 53.81,5.55 US2.4
ECHO3
  Top 0.305: U1.36 74.64,37.12 79.92,31.84 US3.4
ECHO4
  Top 0.305: U1.62 51.86,67.52 50.8,68.58 46.99,68.58 43.18,72.39 43.18,76.2 46.19,79.21 US4.4
ECHO5
  Top 0.305: U1.27 55.86,24.15 59.69,20.32 74.93,20.32 82.81,12.44 US5.4
ECHO6
  Top 0.305: U1.38 88.92,38.12 90.17,39.37 90.17,44.45 91.83,46.11 US6.4
ESC1
  Top 0.305: U1.2 47.55,42.62 41.91,48.26 33.02,48.26 25.4,55.88 25.4,71.12 13.52,83 ESC_1.3
ESC2  (via drill 0.35)
  Top 0.305: U1.15 47.55,36.12 38.1,26.67 38.1,15.24 v36.83,13.97 | v31.75,11.43 15.24,11.43 11.54,7.73 ESC_2.3
  Bottom 0.305: v36.83,13.97 34.29,11.43 v31.75,11.43
ESC3
  Top 0.305: U1.33 67.25,35.62 87.63,15.24 87.63,8.89 88.9,7.62 95.25,7.62 95.54,7.33 ESC_3.3
ESC4  (via drill 0.35)
  Top 0.305: v81.28,65.41 81.28,56.52 80.64,55.88 78.74,55.88 73.66,50.8 61.58,50.8 57.86,47.08 U1.50 | v83.19,78.74 83.82,79.38 94.61,79.38 95.54,80.3 ESC_4.3
  Bottom 0.305: v83.19,78.74 81.92,77.47 81.92,66.04 v81.28,65.41
GND  (via drill 0.35)
  Top 0.203: U2.11 66.71,70.77 C17.2 | U2.9 67.51,70.05 v68.58,71.12 | U2.20 66.71,64.81 66.67,64.77 65.67,64.77 v64.14,66.3 v64.14,66.31 U2.18
  Top 0.305: C18.2 62.29,66.3 v64.14,66.3 | U1.18 51.36,35.56 v50.8,35.56 | U1.12 50.8,37.62 v50.8,38.1 | U1.63 51.36,43.18 v52.07,43.18 | R2.2 61.91,8.89 v60.33,8.89
  Top 0.406: IC1.6 13.03,60.63 IC1.9 12.38,60.63 IC1.3 IC1.4 | Y2.2 v41.91,41.91 | X1.5 90.39,70.86 v92.45,70.86
  Top 0.508: U5.2 v33.02,66.04 | C16.2 v34.29,71.12
  Top 0.61: 64.77,66.3 v64.14,66.3
  Top 0.813: C13.2 v33.02,66.04 | R4.2 66.99,16.51 v64.77,16.51 | R6.2 72.71,8.89 v73.66,8.89 | C15.2 58.74,26.67 v59.69,26.67 | C8.2 66.04,32.7 v66.04,31.75 | C7.2 v49.53,25.4 | CR1.2 v30.48,15.24 | v49.53,52.07 C10.2 | v46.99,52.07 C12.2 | U3.7 22.23,22.23 U3.EPAD v22.86,25.4 | C3.2 v19.05,30.48 20,31.43 C2.2 | LED1.C v13.75,63.28 12.7,62.23 IC1.9 11.72,59.98 IC1.4 | C4.2 7.64,59.98 IC1.4 | C5.2 10.5,58.4 IC1.4 | C18.2 61.91,66.04 v60.96,66.04 | SJ1.1 32.51,44.45 v31.75,44.45 | C6.2 38.42,44.45 v39.37,44.45 | C9.2 v67.31,46.99 | C14.2 v67.31,44.45 | C11.2 v38.1,35.56 | C17.2 v63.5,72.39
  pour Bottom (isolate 0.813): 0,90.17 0,0 99.06,0 100.33,0 100.33,90.17
N$1
  Top 0.305: X2.3 66.79,6.46 67.94,7.62 69.85,7.62 R5.1
N$2
  Top 0.203: U2.10 67.11,72.27
  Top 0.254: 67.11,72.27 C17.1
N$3
  Top 0.305: X1.2 88.73,68.42 88.27,67.94 88.27,62.87 89.53,62.87 90.17,62.23 R14.2
N$4
  Top 0.305: X2.2 65.41,5.2 65.41,7.3 R3.1
N$5
  Top 0.305: X2.1 63.79,6.64 64.77,7.62 R1.1
N$6
  Top 0.305: U1.5 47.78,41.12 45.79,43.11 Y2.1
N$7
  Top 0.305: R15.2 87,67.94 88.27,69.22 X1.3
N$8  (via drill 0.35)
  Top 0.305: X1.1 89.53,66.81 v89.53,66.67
  Bottom 0.305: v89.53,66.67 89.53,64.77 5VUSB.1
N$9
  Top 0.305: U1.6 44.54,40.62 Y2.3
N$12
  Top 0.813: U3.1 25.4,20.67 25.4,19.05 20,19.05 C1.2
N$13
  Top 0.813: U3.4 25.68,25.36 R7.1
N$14
  Top 0.813: C1.1 11.09,17.78 L1.2 | U3.8 18.41,20.95 16.83,19.37 C1.1 | CR1.1 17.78,15.24 16.83,16.19 C1.1
N$15
  Top 0.305: U1.31 57.86,29.45 C15.1
N$16
  Top 0.305: U1.47 61.99,42.62 C14.1
N$19
  Top 0.305: U1.56 54.86,52.54 LED3.C
N$20
  Top 0.305: U1.54 55.86,46.97 60.96,52.07 LED2.C
NRST  (via drill 0.35)
  Top 0.305: U1.7 47.74,40.12 47.2,39.58 40.64,39.58 38.1,42.12 C6.1 R8.1 33.21,42.23 SJ1.2 29.34,42.42 29.21,42.55 29.21,46.99 v30.48,48.26 | SWD.3 82.92,73.39 82.55,73.03 v80.9,73.03 | v78.74,69.22 78.74,58.42 76.83,58.42 73.66,55.24 62.23,55.24 59.69,57.78 v57.78,57.78 | v33.02,50.8 v40.01,57.78 | v42.55,60.33 v44.45,60.33
  Bottom 0.305: v80.9,73.03 78.74,73.03 v78.74,69.22 | v57.78,57.78 52.7,57.78 50.16,60.33 v44.45,60.33 | v30.48,48.26 v33.02,50.8 | v40.01,57.78 v42.55,60.33
PB3
  Top 0.305: U1.55 55.36,47.74 61.59,53.98 74.93,53.98 78.11,57.15 80.01,57.15 80.01,74.93 81.01,75.93 SWD.4
SCL
  Top 0.203: 75.83,67.26 R10.1
  Top 0.254: Q1.3 75.83,67.26
  Top 0.305: U1.58 53.86,58.94 57.15,62.23 57.15,74.93 58.42,76.2 63.5,76.2 | 63.5,76.2 64.69,77.39 PRESSURE.3 | 63.5,76.2 73.66,76.2 74.3,76.83 | I2C.3 77.73,80.27 74.3,76.83 | R10.1 75.88,67.31 74.93,67.31 74.3,67.94 74.3,76.83
SCL_1.8V
  Top 0.203: U2.23 67.91,63.85 R12.1
  Top 0.254: Q1.4 70.28,62.98 R12.1
SDA  (via drill 0.35)
  Top 0.203: 74.03,61.33 Q1.6
  Top 0.254: R11.1 v71.12,59.69 72.39,59.69 74.03,61.33
  Top 0.305: U1.59 53.36,59.71 v55.88,62.23 55.88,78.74 | PRESSURE.5 55.88,78.97 55.88,78.74 | 55.88,78.74 v60.96,78.74 | v68.58,78.74 73.66,78.74 75.19,80.27 I2C.4 | v64.77,61.59 59.05,61.59 v58.42,62.23
  Bottom 0.305: v60.96,78.74 v68.58,78.74 | v55.88,62.23 v58.42,62.23 | v64.77,61.59 66.67,59.69 v71.12,59.69
SDA_1.8V
  Top 0.203: U2.24 68.31,65.21 71.88,65.21 72.39,65.72 | R13.1 72.39,65.72 | Q1.1 74.93,61.48 74.93,64.77 73.98,65.72 72.39,65.72
SWDCLK
  Top 0.305: U1.49 58.36,46.93 60.96,49.53 73.66,49.53 78.74,54.61 83.82,54.61 84.13,54.92 SWD.1
SWDIO
  Top 0.305: U1.46 71.33,42.12 72.39,43.18 72.39,46.99 78.74,53.34 83.82,53.34
  Top 0.406: 83.82,53.34 85.09,54.61 85.09,66.04 86.36,67.31 86.36,70.48 86,70.85 SWD.2
TRIG1
  Top 0.305: U1.10 26.15,38.62 24.13,40.64 24.13,45.72 21.59,48.26 15.24,48.26 12.52,45.54 US1.3
TRIG2
  Top 0.305: U1.20 52.36,16.22 54.61,13.97 54.61,8.89 51.27,5.55 US2.3
TRIG3
  Top 0.305: U1.35 72.6,36.62 80.01,29.21 95.91,29.21 US3.3
TRIG4
  Top 0.305: U1.61 52.36,68.29 50.8,69.85 46.99,69.85 44.45,72.39 44.45,76.2 48.73,80.48 US4.3
TRIG5
  Top 0.305: U1.26 55.36,23.38 59.69,19.05 73.66,19.05 80.27,12.44 US5.3
TRIG6
  Top 0.305: U1.37 92.23,37.62 92.71,38.1 92.71,41.91 94.37,43.57 US6.3
USART1_RX
  Top 0.305: U1.43 73.64,40.62 76.2,43.18 76.2,46.99 78.74,49.53 88.9,49.53 90.17,50.8 90.17,55.88 92.5,58.21 SERIAL.4
USART1_TX
  Top 0.305: U1.42 74.41,40.12 77.47,43.18 77.47,46.99 78.74,48.26 90.17,48.26 91.44,49.53 91.44,54.61 92.5,55.67 SERIAL.3
USART2_RX
  Top 0.305: U1.17 47.72,30.48 46.99,30.48 45.72,29.21 45.72,17.78 38.97,11.03 RPI.4
USART2_TX
  Top 0.305: U1.16 48.32,35.62 44.45,31.75 44.45,19.05 36.43,11.03 RPI.3
VBAT
  Top 0.813: U3.5 20.04,26.71 C2.1 23.18,29.21 27.94,29.21 28.89,28.26 R7.2 28.89,25.08 | 27.3,23.5 26.67,23.5 | 26.67,23.5 U3.3 25.68,22.86 | 28.89,25.08 27.94,24.13 | 27.94,24.13 27.3,23.5 | U3.2 26.04,22.23 27.3,23.5 | 25.68,22.86 U3.2 | 26.67,23.5 26.04,22.86 25.68,22.86 | BAT_IN.1 19.23,9.07 20.32,10.16 34.29,10.16 34.29,19.05 29.21,19.05 28.89,19.37 28.89,22.86 | 28.89,22.86 28.89,24.13 | 28.89,24.13 28.89,25.08 | U3.2 26.67,22.23 | 26.67,22.23 28.25,22.23 28.41,22.39 | 28.89,22.86 28.41,22.39 | 28.41,22.39 27.94,22.86 | 27.94,22.86 27.94,24.13 | 28.41,22.39 28.41,23.66 28.89,24.13 | 27.94,22.86 27.3,22.86 26.67,22.23